# EAGLE design ASL2111 (EAGLE 6.3)
DATABASE: ./../../../../../Components/TinyCircuits_Part_Database.txt
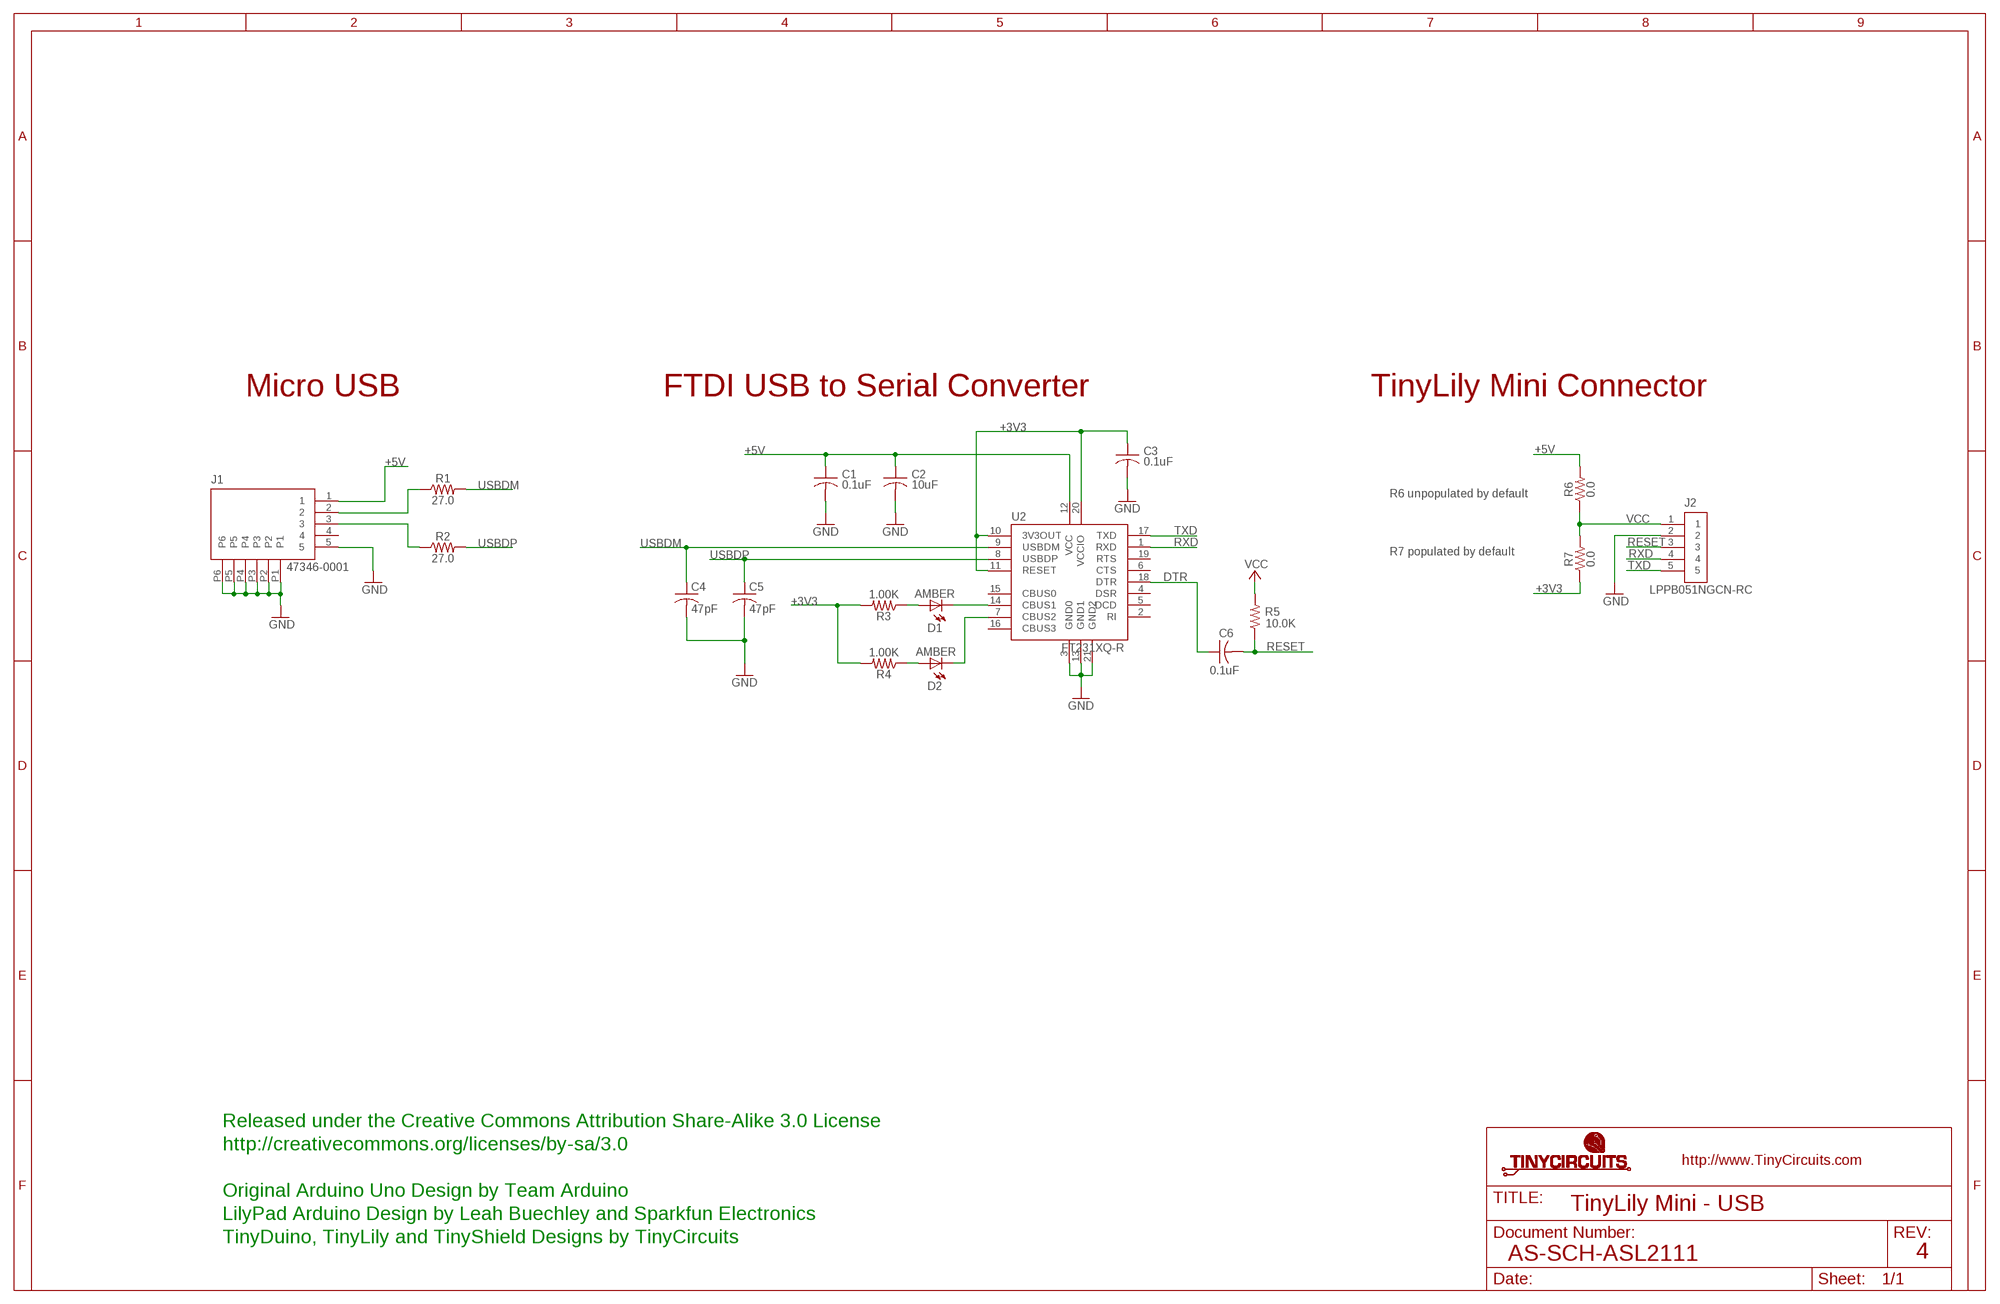
[diagram p0: schematic, sheet 1]

## Parts
C1  0.1uF  AS-ITM-00008  [C0402]
C2  10uF  AS-ITM-00002  [C0603]
C3  0.1uF  AS-ITM-00008  [C0402]
C4  47pF  AS-ITM-00241  [0402]
C5  47pF  AS-ITM-00241  [0402]
C6  0.1uF  AS-ITM-00008  [C0402]
D1  AMBER  AS-ITM-00026  [LNJ_LED]
D2  AMBER  AS-ITM-00026  [LNJ_LED]
J1  47346-0001  AS-ITM-00021  [MICRO_USB]
J2  LPPB051NGCN-RC  AS-ITM-00037  [1X5_.05_RA_TH_RECPT]
R1  27.0  AS-ITM-00240  [0402]
R2  27.0  AS-ITM-00240  [0402]
R3  1.00K  AS-ITM-00003  [0402]
R4  1.00K  AS-ITM-00003  [0402]
R5  10.0K  AS-ITM-00032  [0402]
R6  0.0  AS-ITM-00076  [0402]
R7  0.0  AS-ITM-00076  [0402]
U2  FT231XQ-R  AS-ITM-00223  [QFN20]

## Nets
+3V3: C3.1 R3.2 R4.2 R7.1 U2.10(3V3OUT) U2.11(RESET) U2.20(VCCIO)
+5V: C1.1 C2.1 J1.1 R6.2 U2.12(VCC)
DTR: C6.1 U2.18(DTR)
GND: C1.2 C2.2 C3.2 C4.2 C5.2 J1.5 J1.P1 J1.P2 J1.P3 J1.P4 J1.P5 J1.P6 J2.2 U2.3(GND0) U2.13(GND1) U2.21(GND2)
N$1: D2.C U2.7(CBUS2)
N$2: D1.A R3.1
N$7: D2.A R4.1
N$14: J1.2 R1.1
N$15: J1.3 R2.1
N$16: D1.C U2.14(CBUS1)
RESET: C6.2 J2.3 R5.1
RXD: J2.4 U2.1(RXD)
TXD: J2.5 U2.17(TXD)
USBDM: C4.1 R1.2 U2.9(USBDM)
USBDP: C5.1 R2.2 U2.8(USBDP)
VCC: J2.1 R5.2 R6.1 R7.2
Unconnected: J1.4 U2.2(RI) U2.4(DSR) U2.5(DCD) U2.6(CTS) U2.15(CBUS0) U2.16(CBUS3) U2.19(RTS)

## Notes on the sheet
- Micro USB | FTDI USB to Serial Converter | TinyLily Mini Connector
- R6 unpopulated by default
- R7 populated by default
- Released under the Creative Commons Attribution Share-Alike 3.0 License
- http://creativecommons.org/licenses/by-sa/3.0
- Original Arduino Uno Design by Team Arduino
- TinyLily Mini - USB
- LilyPad Arduino Design by Leah Buechley and Sparkfun Electronics
- TinyDuino, TinyLily and TinyShield Designs by TinyCircuits
- AS-SCH-ASL2111 | 4

## Library data of the parts
C1 C3 C6 = tinycircuits:AS-ITM-00008: CAP CER 0.1UF 16V 10% X5R 0402; PARTNO: AS-ITM-00008
C2 = tinycircuits:AS-ITM-00002: CAP CER 10UF 10V 20% X5R 0603; PARTNO: AS-ITM-00002
C4 C5 = tinycircuits:AS-ITM-00241: CAP CER 47PF 50V 5% NP0 0402; PARTNO: AS-ITM-00241
D1 D2 = tinycircuits:AS-ITM-00026: LED AMBER SIDE VIEW SMD; PARTNO: AS-ITM-00026
J1 = tinycircuits:AS-ITM-00021: CONN RCPT 5POS MICRO USB R/A; PARTNO: AS-ITM-00021
J2 = tinycircuits:AS-ITM-00037: CONN HEADER .050" 5POS TH RA RECPT; PARTNO: AS-ITM-00037
R1 R2 = tinycircuits:AS-ITM-00240: RES 27 OHM 1/16W 5% 0402 SMD; PARNTO: AS-ITM-00240
R3 R4 = tinycircuits:AS-ITM-00003: RES 1.00K OHM 1/16W 1% 0402; PARTNO: AS-ITM-00003
R5 = tinycircuits:AS-ITM-00032: RES 10.0K OHM 1/16W 1% 0402 SMD; PARTNO: AS-ITM-00032
R6 R7 = tinycircuits:AS-ITM-00076: RES 0.0 OHM 1/16W 1% 0402 SMD; PARTNO: AS-ITM-00076
U2 = tinycircuits:AS-ITM-00223: IC USB SERIAL FULL UART 20QFN; PARTNO: AS-ITM-00223

## Net classes
2 gnd: width 0.305 mm, drill 0.559 mm, clearance 0.254 mm

## Board
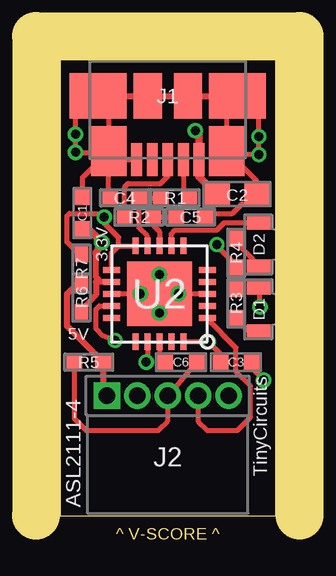
[diagram p1: board, top side]
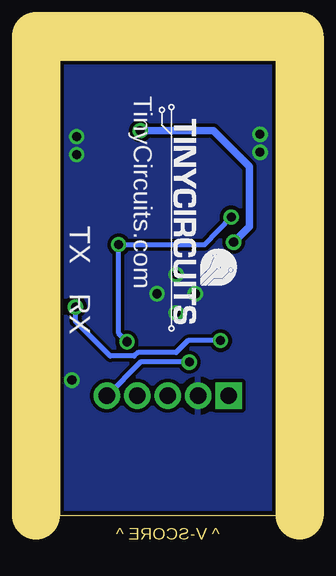
[diagram p2: board, bottom side, seen from below]

Size 9 x 19 mm. Coordinates in mm from the lower left corner, seen from the top.
Outline: 0,0 9,0 9,19 0,19 0,0
Copper layers (1*16): Top 0.035mm / dielectric 1.5mm / Bottom 0.035mm
Design rules "default *": minimum track width 8mil, minimum drill 15mil, track to track 6mil, track to pad 6mil, pad to pad 6mil, via to via 6mil, smd to smd 6mil, copper to edge 6mil, drill to drill 8mil, minimum pad ring 8mil, minimum via ring 5mil, stop-mask expansion 4mil, vias tented up to drill 25mil, thermal gap 10mil
tRestrict: 1 lines
bRestrict: 1 lines
Milling: 3 lines

### Footprints (pad centres in the part's own frame; a part is rotated, then mirrored left to right if it is on the bottom)
C0402 = smd 0.65 x 0.6: 1 -0.65,0; 2 0.65,0
C0603 = smd 1.1 x 1: 1 -0.85,0; 2 0.85,0
0402 = smd 0.65 x 0.55: 1 -0.6,0; 2 0.6,0
LNJ_LED = smd 1 x 0.55: A 0,0.9; C 0,-0.9
MICRO_USB = smd 1.38 x 0.45: 1 2.66,1.3; 2 2.66,0.65; 3 2.66,0; 4 2.66,-0.65; 5 2.66,-1.3 | smd 2.1 x 1.475: P1 2.3,-2.462; P2 2.3,2.462 | smd 1.9 x 2.375: P3 0,2.913; P4 0,-2.913 | smd 1.9 x 1.175: P5 0,0.838; P6 0,-0.838
1X5_.05_RA_TH_RECPT = drill 0.7 pad 1.016 square: 1 0,2.54 | drill 0.7 pad 1.016: 2 0,1.27; 3 0,0; 4 0,-1.27; 5 0,-2.54
QFN20 = smd 0.7 x 0.25: 1 -2,1; 2 -2,0.5; 3 -2,0; 4 -2,-0.5; 5 -2,-1; 11 2,-1; 12 2,-0.5; 13 2,0; 14 2,0.5; 15 2,1 | smd 0.25 x 0.7: 6 -1,-2; 7 -0.5,-2; 8 0,-2; 9 0.5,-2; 10 1,-2; 16 1,2; 17 0.5,2; 18 0,2; 19 -0.5,2; 20 -1,2 | smd 2.7 x 2.7: 21 0,0

### Placement (x,y rotation side)
C1  0.94,12.61 90 top
C2  7.39,13.4 0 top
C3  7.35,6.4 0 top
C4  2.7,13.25 180 top
C5  5.45,12.45 0 top
C6  5.05,6.4 0 top
D1  8.3,8.6 180 top
D2  8.3,11.3 180 top
J1  4.5,17.5 270 top
J2  4.5,5 90 top
R1  4.8,13.25 180 top
R2  3.3,12.45 0 top
R3  7.35,8.85 90 top
R4  7.35,10.95 270 top
R5  1.2,6.4 0 top
R6  0.9,9.1 270 top
R7  0.9,10.3 270 top
U2  4.15,9.25 180 top
U$1  [DOCFIELD-TINYCIRCUITS-PCB]  28.5,-11 0 top  (outside the outline)

### Tracks (layer width: path | path; a pad name or v marks a point on that pad's centre or on a via)
+3V3  (via drill 0.38)
  Top 0.203: U2.11 2.15,10.95 2.45,11.25 | 2.45,11.25 U2.10 | R4.2 R3.2 7.3,10.1 7.3,10.5 6.55,11.25 v6.55,11.3 | 0.84,10.86 0.3,11.4 0.3,12.5 0.4,12.6 1.7,12.6 v1.85,12.45 1.85,12.2 2.45,11.6 2.45,11.25 | C3.1 6.7,6.75 v6.2,7.25 U2.20
  Top 0.254: 0.84,10.86 0.88,10.9 R7.1
  Bottom 0.203: v1.85,12.45 2.95,11.3 v6.55,11.3 6.55,7.6 v6.2,7.25
+5V  (via drill 0.38)
  Top 0.203: C1.1 1.16,11.96 | 1.5,9.75 1.6,9.85
  Top 0.254: U2.12 1.5,9.75 1.5,9.2 0.9,8.54 R6.2 | 1.6,9.85 1.5,9.95 1.5,10.95
  Top 0.305: C2.1 5.8,14.14 J1.1 5.8,15.9 v5.65,16.05 | 1.16,11.96 v1.75,11.4 1.5,10.95
  Bottom 0.305: v5.65,16.05 2.6,16.05 1.1,14.55 1.1,12.05 v1.75,11.4
DTR
  Top 0.203: U2.18 4.15,6.75 C6.1
GND  (via drill 0.38)
  Top 0.203: J1.P1 2.04,13.61 2.1,13.55 C4.2 | U2.3 U2.21 | U2.21 U2.13 | J1.P4 2.04,17.05 J1.P1 | J1.P1 2.4,14.84 J1.5 | J1.P3 6.96,17.5 J1.P2 8.24,13.92 C2.2 7.84,13 7.6,13 7.2,12.6 6.3,12.6 6.15,12.45 C5.2 | C1.2 0.94,14.1 J1.P1 | 8,6.6 C3.2 8,6.15 v8.5,5.65 | v4.15,10.05 U2.21 | 0.7,15.14 1.5,15.14 | 0.66,15.1 v0.66,15.9 | 0.66,15.95 0.66,16.75 | 8.31,15.9 8.31,16.7 | v8.3,15.06 7.5,15.06 | 8.29,15.85 v8.29,15.05
  Top 0.254: J1.P4 J1.P6 J1.P5 J1.P3 | 8.29,15.85 8.3,15.84 v8.3,15.8 8.3,15.89 8.31,15.9 | 7.5,15.06 7.36,15.2 J1.P2 | 0.7,15.14 0.69,15.15 v0.65,15.15 | v0.66,15.9 v0.65,15.9 0.65,15.94 0.66,15.95 | v8.3,15.06 v8.3,15.05
  Bottom 0.203: v8.5,5.65 8.5,5.7 8.55,5.75
  other vias: 4.95,9.25 4.15,8.45 3.35,9.25
  pour Bottom: 0,19 9,19 9,0 0,0
N$1
  Top 0.203: U2.7 4.65,11.75 4.8,11.9 6.55,11.9 6.85,12.2 D2.C
N$2
  Top 0.203: D1.A 7.85,7.7 R3.1
N$7
  Top 0.203: R4.1 7.3,11.45 D2.A
N$14
  Top 0.203: J1.2 5.15,13.5 R1.1
N$15
  Top 0.203: R2.1 2.7,13.7 2.85,13.85 4.2,13.85 4.5,14.15 J1.3
N$16  (via drill 0.38)
  Top 0.203: D1.C v8.35,8.7 | v2.3,7.3 1.8,7.5 1.5,7.8 1.5,8.6 1.65,8.75 U2.14
  Bottom 0.203: v2.3,7.3 3.65,7.3 4.15,6.8 5.75,6.8 5.9,6.65 6.9,6.65 8.35,8.1 v8.35,8.7
RESET
  Top 0.203: C6.2 J2.3 4.5,3.95 4.1,3.55 1.1,3.55 0.6,4.05 R5.1
RXD
  Top 0.203: J2.4 5.77,3.93 6.15,3.55 7.4,3.55 7.95,4.1 7.95,5.4 7.35,6 7.35,7 6.15,8.2 U2.1
TXD  (via drill 0.38)
  Top 0.203: U2.17 3.65,6.45 v3.6,6.4
  Bottom 0.203: v3.6,6.4 5.64,6.4 J2.5
USBDM
  Top 0.203: U2.9 3.65,11.65 3.3,12 C4.1 R1.2
USBDP
  Top 0.203: R2.2 3.9,12.5 | R2.2 3.9,12.1 4.15,11.85 U2.8 | R2.2 C5.1
VCC
  Top 0.254: J2.1 1.8,5.16 R5.2 0.3,7.9 0.3,9.24 0.76,9.7 R6.1

### Text on the board
Dimension: ^ V-SCORE ^
tPlace: 3.3V | 5V | TinyCircuits | ASL2111-4
bPlace: TinyCircuits.com | TX | RX
Document: FABRICATION DRAWING | NOTES: | 1. PRINTED CIRCUIT BOARD MADE FROM NEMA GRADE FR-4 EPOXY LAMINATE | WITH 1 OUNCE COPPER PLATING AND .024 THICKNESS. | 2. ALL DIMENSIONS ARE GIVEN IN INCHES. | 3. CIRCUIT PATHS ARE FOR REFERENCE ONLY. | 4. HOLE SIZES SHOWN ARE FINISHED DIAMETERS AFTER PLATING. | 5. BOARD PLATED USING REFLOW OR SIMILAR METHOD. | 6. BOARD TO HAVE BLUE SOLDER MASK ON PLATED SURFACES USING WET FILM | 7. SILKSCREEN BOARD USING WHITE INK. | SR100 OR SR1010 EPOXY. EQUIVALENT WET OR DRY FILM MAY BE USED. | 8. THE FOLLOWING INFORMATION APPLIES TO THIS BOARD: | * 2 COPPER LAYERS | * .024 BOARD THICKNESS | * REQUIRES TOP SIDE SILKSCREEN | Released under the Creative Commons Attribution Share-Alike 3.0 License | http://creativecommons.org/licenses/by-sa/3.0 | Original Arduino Uno Design by Team Arduino | LilyPad Arduino Design by Leah Buechley and Sparkfun Electronics | TinyDuino, TinyLily and TinyShield Designs by TinyCircuits | TinyLily Mini - USB | AS-PCB-ASL2111 | 4